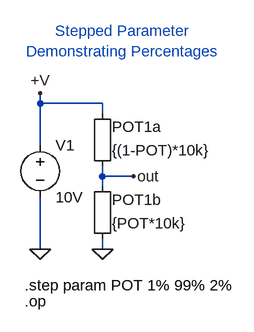
[diagram p0: schematic potentiometer demo2.asc]
potentiometer demo2.asc, the LTspice schematic file:
Version 4
SHEET 1 880 680
WIRE -416 192 -416 176
WIRE -320 192 -416 192
WIRE -320 208 -320 192
WIRE -416 256 -416 192
WIRE -320 304 -320 288
WIRE -272 304 -320 304
WIRE -320 320 -320 304
WIRE -416 416 -416 336
WIRE -320 416 -320 400
FLAG -416 416 0
FLAG -416 176 +V
FLAG -320 416 0
FLAG -272 304 out
SYMBOL voltage -416 240 R0
WINDOW 123 0 0 Left 0
WINDOW 39 0 0 Left 0
SYMATTR InstName V1
SYMATTR Value 10V
SYMBOL Misc\\EuropeanResistor -336 416 M180
WINDOW 0 31 76 Left 2
WINDOW 3 31 40 Left 2
SYMATTR InstName POT1b
SYMATTR Value {POT*10k}
SYMBOL Misc\\EuropeanResistor -336 304 M180
WINDOW 0 31 76 Left 2
WINDOW 3 31 40 Left 2
SYMATTR InstName POT1a
SYMATTR Value {(1-POT)*10k}
TEXT -440 472 Left 2 !.step param POT 1% 99% 2%
TEXT -440 496 Left 2 !.op
TEXT -288 96 Center 2 ;Stepped Parameter\nDemonstrating Percentages

The netlist it stands for:
* potentiometer demo2.asc
V1 +V 0 10V
R§POT1b 0 out {POT*10k}
R§POT1a out +V {(1-POT)*10k}
.step param POT 1% 99% 2%
.op
* Stepped Parameter
* Demonstrating Percentages
.backanno
.end